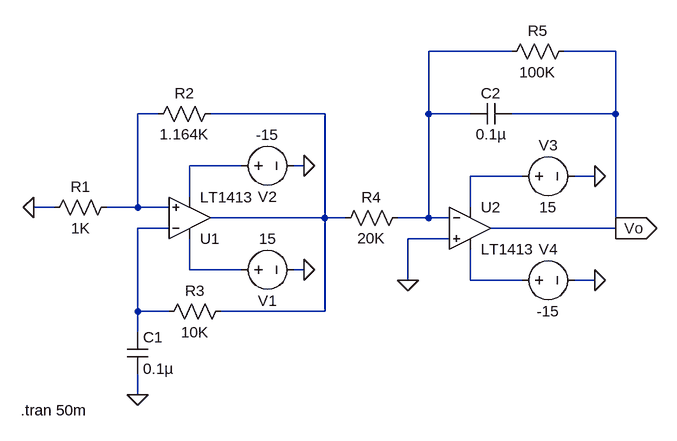
[diagram p0: schematic Run_4.asc]
Run_4.asc, the LTspice schematic file:
Version 4
SHEET 1 920 680
WIRE 672 -64 544 -64
WIRE 832 -64 752 -64
WIRE 128 32 96 32
WIRE 384 32 208 32
WIRE 544 32 544 -64
WIRE 608 32 544 32
WIRE 832 32 832 -64
WIRE 832 32 672 32
WIRE 256 112 176 112
WIRE 352 112 336 112
WIRE 688 128 608 128
WIRE 800 128 768 128
WIRE 176 160 176 112
WIRE -32 176 -64 176
WIRE 96 176 96 32
WIRE 96 176 48 176
WIRE 144 176 96 176
WIRE 608 176 608 128
WIRE 384 192 384 32
WIRE 384 192 208 192
WIRE 416 192 384 192
WIRE 544 192 544 32
WIRE 544 192 496 192
WIRE 576 192 544 192
WIRE 144 208 96 208
WIRE 832 208 832 32
WIRE 832 208 640 208
WIRE 576 224 512 224
WIRE 176 272 176 224
WIRE 256 272 176 272
WIRE 352 272 336 272
WIRE 512 288 512 224
WIRE 608 288 608 240
WIRE 688 288 608 288
WIRE 800 288 768 288
WIRE 96 336 96 208
WIRE 144 336 96 336
WIRE 384 336 384 192
WIRE 384 336 224 336
WIRE 96 368 96 336
WIRE 96 464 96 432
FLAG 352 112 0
FLAG 352 272 0
FLAG -64 176 0
FLAG 96 464 0
FLAG 800 128 0
FLAG 800 288 0
FLAG 512 288 0
FLAG 832 208 Vo
IOPIN 832 208 Out
SYMBOL OpAmps\\LT1413 176 256 M180
SYMATTR InstName U1
SYMBOL voltage 240 272 M90
WINDOW 0 32 56 VTop 2
WINDOW 3 -32 56 VBottom 2
WINDOW 123 0 0 Left 0
WINDOW 39 0 0 Left 0
SYMATTR InstName V1
SYMATTR Value 15
SYMBOL voltage 240 112 M90
WINDOW 0 32 56 VTop 2
WINDOW 3 -32 56 VBottom 2
WINDOW 123 0 0 Left 0
WINDOW 39 0 0 Left 0
SYMATTR InstName V2
SYMATTR Value -15
SYMBOL res 64 160 R90
WINDOW 0 0 56 VBottom 2
WINDOW 3 32 56 VTop 2
SYMATTR InstName R1
SYMATTR Value 1K
SYMBOL res 224 16 R90
WINDOW 0 0 56 VBottom 2
WINDOW 3 32 56 VTop 2
SYMATTR InstName R2
SYMATTR Value 1.164K
SYMBOL res 240 320 R90
WINDOW 0 0 56 VBottom 2
WINDOW 3 32 56 VTop 2
SYMATTR InstName R3
SYMATTR Value 10K
SYMBOL cap 80 368 R0
SYMATTR InstName C1
SYMATTR Value 0.1µ
SYMBOL res 512 176 R90
WINDOW 0 0 56 VBottom 2
WINDOW 3 32 56 VTop 2
SYMATTR InstName R4
SYMATTR Value 20K
SYMBOL OpAmps\\LT1413 608 144 R0
SYMATTR InstName U2
SYMBOL voltage 672 128 R270
WINDOW 0 32 56 VTop 2
WINDOW 3 -32 56 VBottom 2
WINDOW 123 0 0 Left 0
WINDOW 39 0 0 Left 0
SYMATTR InstName V3
SYMATTR Value 15
SYMBOL voltage 672 288 R270
WINDOW 0 32 56 VTop 2
WINDOW 3 -32 56 VBottom 2
WINDOW 123 0 0 Left 0
WINDOW 39 0 0 Left 0
SYMATTR InstName V4
SYMATTR Value -15
SYMBOL cap 672 16 R90
WINDOW 0 0 32 VBottom 2
WINDOW 3 32 32 VTop 2
SYMATTR InstName C2
SYMATTR Value 0.1µ
SYMBOL res 768 -80 R90
WINDOW 0 0 56 VBottom 2
WINDOW 3 32 56 VTop 2
SYMATTR InstName R5
SYMATTR Value 100K
TEXT -84 488 Left 2 !.tran 50m

The netlist it stands for:
* Run_4.asc
XU1 N002 N006 N007 N004 N003 LT1413  ; pins In+ In- V+ V- OUT
V1 N007 0 15
V2 N004 0 -15
R1 N002 0 1K
R2 N003 N002 1.164K
R3 N003 N006 10K
C1 N006 0 0.1µ
R4 N001 N003 20K
XU2 0 N001 N005 N008 Vo LT1413  ; pins In+ In- V+ V- OUT
V3 N005 0 15
V4 N008 0 -15
C2 Vo N001 0.1µ
R5 Vo N001 100K
.tran 50m
.lib LTC.lib
.backanno
.end